# Altium schematic sheet mcu.schdoc
size 209 x 297 mm; Scale: 1:1; DocumentType: Ñõåìà ýëåêòðè÷åñêàÿ ïðèíöèïèàëüíàÿ; FirstReferrence: ÀÁÂÃ.123456.001; Title1str: {Наименование}; PageSetup: Record=PageOptions¦CenterHorizontal=False¦CenterVertical=False¦PrintScale=0.95¦XCorrection=0.00¦YCorrection=0.00¦PrintKind=1¦BorderSize=5000000¦LeftOffset=0¦BottomOffset=0¦Orientation=1¦PaperLength=1000¦PaperWidth=1000¦Scale=100¦PaperSource=15¦PrintQuality=600¦MediaType=1¦DitherType=10¦PaperKind=A4¦PrintScaleMode=1; DocumentType1str: {Документ}; DocumentType2str: {Документ}
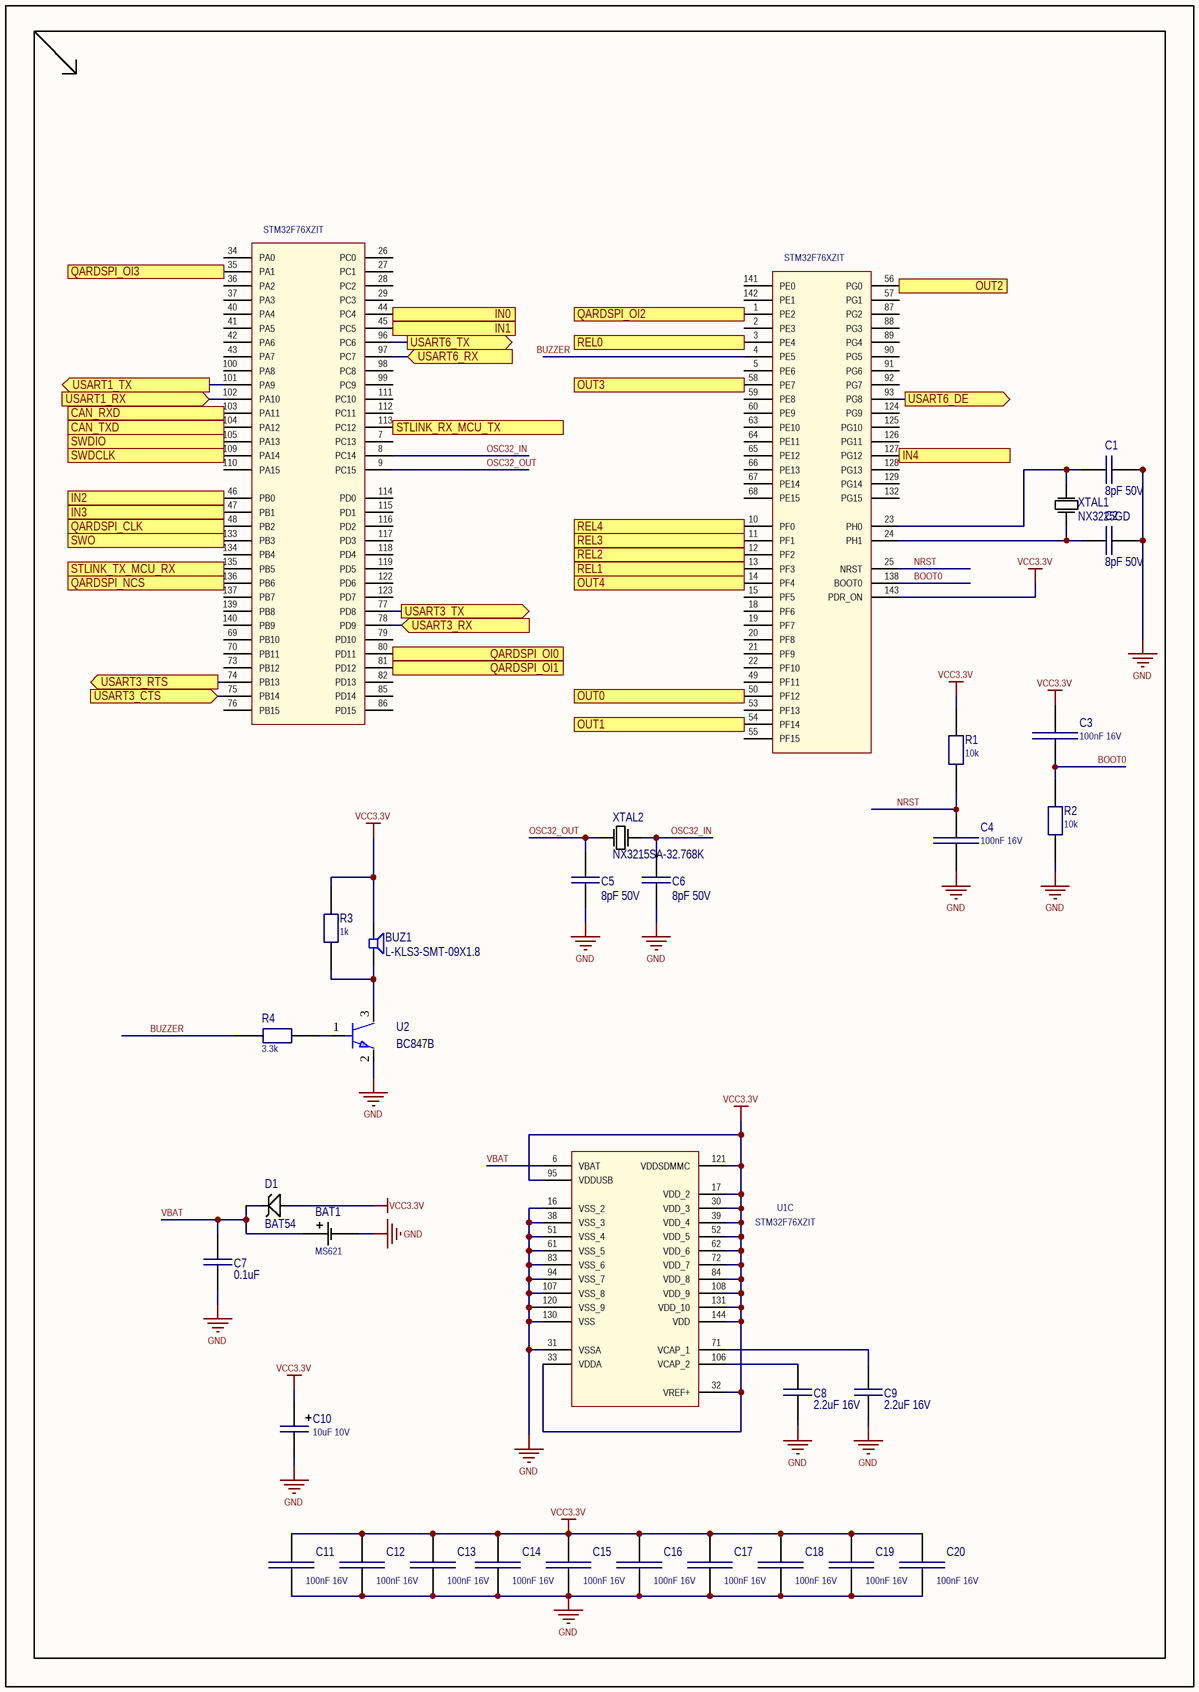
[diagram p0: mcu.schdoc]

## Parts
BAT1  MS621  [MS621]
BUZ1  L-KLS3-SMT-09X1.8  [SPKR_PKMCS0909E4000-R1]
C1  8pF 50V  [C_0603]
C2  8pF 50V  [C_0603]
C3  100nF 16V  [C_0603]
C4  100nF 16V  [C_0603]
C5  8pF 50V  [C_0603]
C6  8pF 50V  [C_0603]
C7  0.1uF  [C_0603]
C8  2.2uF 16V  [C_0603]
C9  2.2uF 16V  [C_0603]
C10  10uF 10V  [TANTAL_TYPE_A]
C11  100nF 16V  [C_0603]
C12  100nF 16V  [C_0603]
C13  100nF 16V  [C_0603]
C14  100nF 16V  [C_0603]
C15  100nF 16V  [C_0603]
C16  100nF 16V  [C_0603]
C17  100nF 16V  [C_0603]
C18  100nF 16V  [C_0603]
C19  100nF 16V  [C_0603]
C20  100nF 16V  [C_0603]
D1  BAT54  [SOT23]
R1  10k  [R_0603]
R2  10k  [R_0603]
R3  1k  [R_0603]
R4  3.3k  [R_0603]
U1  STM32F76XZIT  [TQFP144_M]  (parts A,B,C of 3)
U2  BC847B  [SOT23]
XTAL1  NX3225GD  [NX3225GD]
XTAL2  NX3215SA-32.768K  [XTAL_NX3215SA-32.768K-STD-MUA-8]

## Ports
CAN_RXD (in), CAN_TXD (out), IN0 (in), IN1 (in), IN2 (in), IN3 (in), IN4 (in), OUT0 (out), OUT1 (out), OUT2 (out), OUT3 (out), OUT4 (out), QARDSPI_CLK, QARDSPI_NCS, QARDSPI_OI0, QARDSPI_OI1, QARDSPI_OI2, QARDSPI_OI3, REL0 (out), REL1 (out), REL2 (out), REL3 (out), REL4 (out), STLINK_RX_MCU_TX, STLINK_TX_MCU_RX, SWDCLK, SWDIO, SWO, USART1_RX (in), USART1_TX (out), USART3_CTS (in), USART3_RTS (out), USART3_RX (in), USART3_TX (out), USART6_DE (out), USART6_RX (in), USART6_TX (out)

## Nets
GND: BAT1.0(-) C1.1 C2.1 C4.1 C5.1 C6.1 C7.1 C8.1 C9.1 C10.2 C11.1 C12.1 C13.1 C14.1 C15.1 C16.1 C17.1 C18.1 C19.1 C20.1 R2.1 U1.16(VSS_2) U1.31(VSSA) U1.38(VSS_3) U1.51(VSS_4) U1.61(VSS_5) U1.83(VSS_6) U1.94(VSS_7) U1.107(VSS_8) U1.120(VSS_9) U1.130(VSS) U2.2
VCC3.3V: BUZ1.1 C3.1 C10.1 C11.2 C12.2 C13.2 C14.2 C15.2 C16.2 C17.2 C18.2 C19.2 C20.2 D1.1 R1.2 R3.2 U1.17(VDD_2) U1.30(VDD_3) U1.32(VREF+) U1.33(VDDA) U1.39(VDD_4) U1.52(VDD_5) U1.62(VDD_6) U1.72(VDD_7) U1.84(VDD_8) U1.95(VDDUSB) U1.108(VDD_9) U1.121(VDDSDMMC) U1.131(VDD_10) U1.143(PDR_ON) U1.144(VDD)
BOOT0: C3.2 R2.2 U1.138(BOOT0)
BUZZER: R4.1 U1.4(PE5)
CAN_RXD: U1.103(PA11) ; port CAN_RXD
CAN_TXD: U1.104(PA12) ; port CAN_TXD
IN0: U1.44(PC4) ; port IN0
IN1: U1.45(PC5) ; port IN1
IN2: U1.46(PB0) ; port IN2
IN3: U1.47(PB1) ; port IN3
IN4: U1.127(PG12) ; port IN4
NRST: C4.2 R1.1 U1.25(NRST)
OSC32_IN: C6.2 U1.8(PC14) XTAL2.2(OSC2)
OSC32_OUT: C5.2 U1.9(PC15) XTAL2.1(OSC1)
OUT0: U1.50(PF12) ; port OUT0
OUT1: U1.54(PF14) ; port OUT1
OUT2: U1.56(PG0) ; port OUT2
OUT3: U1.58(PE7) ; port OUT3
OUT4: U1.14(PF4) ; port OUT4
QARDSPI_CLK: U1.48(PB2) ; port QARDSPI_CLK
QARDSPI_NCS: U1.136(PB6) ; port QARDSPI_NCS
QARDSPI_OI0: U1.80(PD11) ; port QARDSPI_OI0
QARDSPI_OI1: U1.81(PD12) ; port QARDSPI_OI1
QARDSPI_OI2: U1.1(PE2) ; port QARDSPI_OI2
QARDSPI_OI3: U1.35(PA1) ; port QARDSPI_OI3
REL0: U1.3(PE4) ; port REL0
REL1: U1.13(PF3) ; port REL1
REL2: U1.12(PF2) ; port REL2
REL3: U1.11(PF1) ; port REL3
REL4: U1.10(PF0) ; port REL4
STLINK_RX_MCU_TX: U1.113(PC12) ; port STLINK_RX_MCU_TX
STLINK_TX_MCU_RX: U1.135(PB5) ; port STLINK_TX_MCU_RX
SWDCLK: U1.109(PA14) ; port SWDCLK
SWDIO: U1.105(PA13) ; port SWDIO
SWO: U1.133(PB3) ; port SWO
USART1_RX: U1.102(PA10) ; port USART1_RX
USART1_TX: U1.101(PA9) ; port USART1_TX
USART3_CTS: U1.75(PB14) ; port USART3_CTS
USART3_RTS: U1.74(PB13) ; port USART3_RTS
USART3_RX: U1.78(PD9) ; port USART3_RX
USART3_TX: U1.77(PD8) ; port USART3_TX
USART6_DE: U1.93(PG8) ; port USART6_DE
USART6_RX: U1.97(PC7) ; port USART6_RX
USART6_TX: U1.96(PC6) ; port USART6_TX
VBAT: BAT1.1(+) C7.2 D1.3 U1.6(VBAT)
NetBUZ1_2: BUZ1.2 R3.1 U2.3
NetC1_2: C1.2 U1.23(PH0) XTAL1.2(OSC2)
NetC2_2: C2.2 U1.24(PH1) XTAL1.1(OSC1)
NetC8_2: C8.2 U1.106(VCAP_2)
NetC9_2: C9.2 U1.71(VCAP_1)
NetR4_2: R4.2 U2.1

Not connected (* = marked no-connect by the designer): U1 2(PE3) 5(PE6) 7(PC13) 15(PF5) 18(PF6) 19(PF7) 20(PF8) 21(PF9) 22(PF10) 26(PC0) 27(PC1) 28(PC2) 29(PC3) 34(PA0) 36(PA2) 37(PA3) 40(PA4) 41(PA5) 42(PA6) 43(PA7) 49(PF11) 53(PF13) 55(PF15) 57(PG1) 59(PE8) 60(PE9) 63(PE10) 64(PE11) 65(PE12) 66(PE13) 67(PE14) 68(PE15) 69(PB10) 70(PB11) 73(PB12) 76(PB15) 79(PD10) 82(PD13) 85(PD14) 86(PD15) 87(PG2) 88(PG3) 89(PG4) 90(PG5) 91(PG6) 92(PG7) 98(PC8) 99(PC9) 100(PA8) 110(PA15) 111(PC10) 112(PC11) 114(PD0) 115(PD1) 116(PD2) 117(PD3) 118(PD4) 119(PD5) 122(PD6) 123(PD7) 124(PG9) 125(PG10) 126(PG11) 128(PG13) 129(PG14) 132(PG15) 134(PB4) 137(PB7) 139(PB8) 140(PB9) 141(PE0) 142(PE1)

## Library data of the parts
BAT1 = MS621: Battery; Part Number: MS621; Alternative Part: *
BUZ1 = BUZZER: Piezoelectric Sounders; Alternative Part: PKLCS1212E40A1-R1; Part Number: L-KLS3-SMT-09X1.8
C1 C2 C5 C6 = CAP_SMD: Capacitor; Part Number: CC0603DRNPO9BN8R0; Alternative Part: *; Value: 8pF 50V
C3 C4 C11-C20 = C0603: Capacitor; Part Number: CC0603KPX7R9BB104; Value: 100nF 16V
C7 = CAP_SMD: Capacitor; Part Number: CC0603KPX7R9BB104; Alternative Part: *; Value: 0.1uF
C8 C9 = CAP_SMD: Capacitor; Part Number: CC0603KRX5R7BB225; Alternative Part: *; Value: 2.2uF 16V
C10 = TANTAL_CAP: Tantal Capacitor; Part Number: 293D106X9010A2TE3; Alternative Part: *; Value: 10uF 10V
D1 = BAT54: Diode; Part Number: BAT54
R1 R2 = RES_SMD: Resistor; Part Number: RC0603FR-0710KL; Alternative Part: *; Value: 10k
R3 = RES_SMD: Resistor; Part Number: RC0603FR-071KL; Alternative Part: *; Value: 1k
R4 = RES_SMD: Resistor; Part Number: RC0603FR-073K3L; Alternative Part: *; Value: 3.3k
U1 = STM32F76XZXT: MCU; Part Number: STM32F765ZGT; C: Copyright (C) 2016 Accelerated Designs. All rights reserved; Vendor: STMicroelectronics; Value: STM32F76XZXT; Manufacturer_Part_Number: STM32F76XZXT; Copyright: Copyright (C) 2016 Accelerated Designs. All rights reserved
U2 = BC847B: Transistor; Part Number: BC847B
XTAL1 = NX3225GD: Crystal Oscillator; Part Number: NX3225GD-8MHZ-EXS00A-CG05041; Alternative Part: *
XTAL2 = NX3215SA-32.768K: Crystal Oscillator; Part Number: NX3215SA-32.768K-10PPM-45KOHM-6PF; Alternative Part: *